# EAGLE design DenkyD4 (EAGLE 7.7.0)
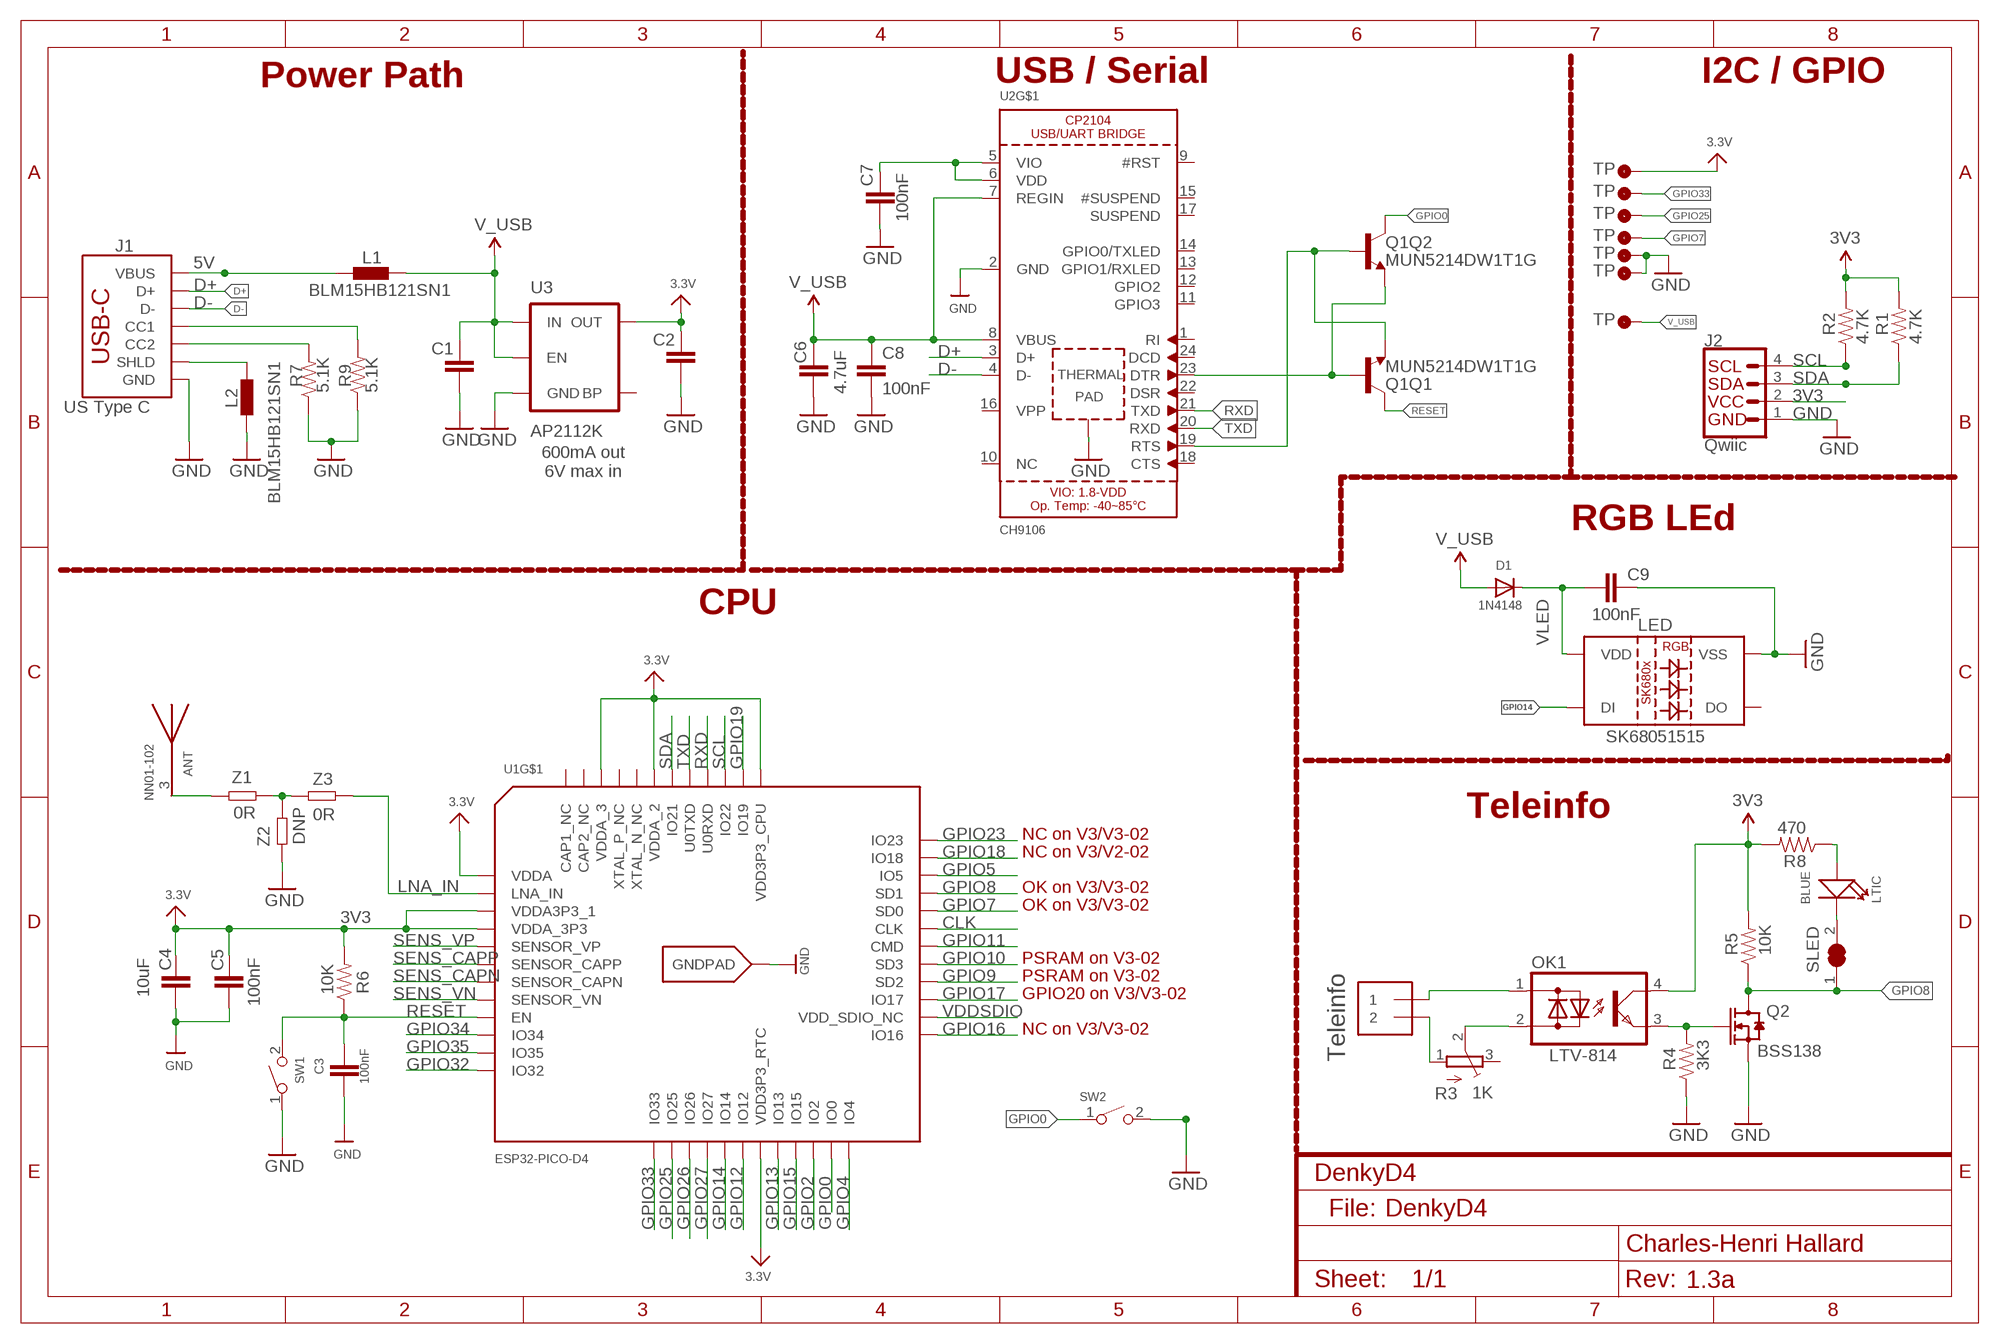
[diagram p0: schematic, sheet 1]
NAME (FRAME-A4L): CNAME: DenkyD4; CREVISION: 1.3a; DESIGNER: Charles-Henri Hallard

## Parts
ANT  NN01-102  NN01-102320  [XCVR_NN03-320]
C1  1.0uF  CAP0402-CAP-OK  [0402-CAP-OK]
C2  1.0uF  CAP0402-CAP-OK  [0402-CAP-OK]
C3  100nF  CAP0402-CAP-OK  [0402-CAP-OK]
C4  10uF  CAP0402-CAP-OK  [0402-CAP-OK]
C5  100nF  CAP0402-CAP-OK  [0402-CAP-OK]
C6  4.7uF  CAP0402-CAP-OK  [0402-CAP-OK]
C7  100nF  CAP0402-CAP-OK  [0402-CAP-OK]
C8  100nF  CAP0402-CAP-OK  [0402-CAP-OK]
C9  100nF  CAP0402-CAP-OK  [0402-CAP-OK]
D1  1N4148  DIODESOD-523  [SOD-523]
J1  US Type C  USB_C_4-LAYER-ISOLATED  [USB-C-16P-4LAYER-ISOLATED]
J2  Qwiic  QWIIC_CONNECTOR  [JST04_1MM_VERT]
J3  KF2EDGR-3.81-2P  1X2-3.5MM-3.5MM  [1X2-3.5MM]
L1  BLM15HB121SN1  [0402]
L2  BLM15HB121SN1  [0402]
LED  SK68051515  [SK6805-1515]
LTIC  BLUE  SMD-LED-CLEAR-BLUE(0402)  [LED-0402]
OK1  LTV-814  SFH6206  [DIL4-SMD]
Q1  MUN5214DW1T1G  MBT3904DW1T1  [DUAL_NPN_SC70-6]
Q2  BSS138  SMD-MOSFET-N-CH-20V-2.1A-CJ2302(SOT-23)  [SOT-323-3]
R1  4.7K  RESISTOR0402-RES  [0402-RES]
R2  4.7K  RESISTOR0402-RES  [0402-RES]
R3  1K  TRIMPOTTC33X  [TC33X]
R4  3K3  RESISTOR0402-RES  [0402-RES]
R5  10K  RESISTOR0402-RES  [0402-RES]
R6  10K  RESISTOR0402-RES  [0402-RES]
R7  5.1K  RESISTOR0402-RES  [0402-RES]
R8  470  RESISTOR0402-RES  [0402-RES]
R9  5.1K  RESISTOR0402-RES  [0402-RES]
SLED  SOLDERJUMPER_CLOSED  [SOLDERJUMPER_CLOSEDWIRE]
SW1  RESET  SMD-BUTTON(2P-3.0X2.5X1.2+0.4MM)  [C498294]
SW2  SMD-BUTTON(2P-3.0X2.5X1.2+0.4MM)  [C498294]
TGG  TP3  [TP60_BOT]
TGG1  TP3  [TP60_BOT]
TGG2  TP3  [TP60_BOT]
TP3  TP3  [TP60_BOT]
U1  ESP32-PICO-D4  [PICO-D4-QFN48]
U2  CH9106  CP2104  [QFN24_4MM_SMSC]
U3  AP2112K  V_REG_LDOSMD  [SOT23-5]
U$3  TP3  [TP60_BOT]
U$6  TP3  [TP60_BOT]
U$11  TP3  [TP60_BOT]
Z1  0R  MATCHNET  [0603-MATCHNET]
Z2  DNP  MATCHNET  [0603-MATCHNET]
Z3  0R  MATCHNET  [0603-MATCHNET]

## Nets
3V3: C2.1 C4.1 C5.1 J2.2 OK1.4(C) R1.2 R2.2 R5.2 R6.2 R8.2 TP3.P$1(TP) U1.1(VDDA) U1.3(VDDA3P3_1) U1.4(VDDA_3P3) U1.19(VDD3P3_RTC) U1.37(VDD3P3_CPU) U1.43(VDDA_2) U1.46(VDDA_3) U3.5(OUT) ; supply symbol labelled 3.3V
5V: J1.VBUS1(VBUS) J1.VBUS2(VBUS) L1.1
CLK: U1.31(CLK)
D+: J1.A6(D+) J1.B6(D+) U2.3(D+)
D-: J1.A7(D-) J1.B7(D-) U2.4(D-)
DTR: Q1.1(Q2:E) Q1.5(Q1:B) U2.23(DTR)
GND: C1.2 C2.2 C3.2 C4.2 C5.2 C6.1 C7.1 C8.2 C9.2 J1.GND J1.GND2(GND) J2.1 L2.2 LED.4(VSS) Q2.2(S) R4.1 R7.1 R9.1 SW1.1 SW2.2 TGG1.P$1(TP) TGG.P$1(TP) U1.EXP(GNDPAD) U2.2(GND) U2.THERM(TP) U3.2(GND) Z2.2
GPIO0: Q1.6(Q2:C) SW2.1 U1.23(IO0)
GPIO2: U1.22(IO2)
GPIO4: U1.24(IO4)
GPIO5: U1.34(IO5)
GPIO7: U1.32(SD0) U$3.P$1(TP)
GPIO8: Q2.3(D) R5.1 SLED.1 U1.33(SD1)
GPIO9: U1.28(SD2)
GPIO10: U1.29(SD3)
GPIO11: U1.30(CMD)
GPIO12: U1.18(IO12)
GPIO13: U1.20(IO13)
GPIO14: LED.1(DI) U1.17(IO14)
GPIO15: U1.21(IO15)
GPIO16: U1.25(IO16)
GPIO17: U1.27(IO17)
GPIO18: U1.35(IO18)
GPIO19: U1.38(IO19)
GPIO23: U1.36(IO23)
GPIO25: U1.14(IO25) U$11.P$1(TP)
GPIO26: U1.15(IO26)
GPIO27: U1.16(IO27)
GPIO32: U1.12(IO32)
GPIO33: U1.13(IO33) U$6.P$1(TP)
GPIO34: U1.10(IO34)
GPIO35: U1.11(IO35)
LNA_IN: U1.2(LNA_IN) Z3.2
N$1: Z1.1 Z2.1 Z3.1
N$2: OK1.3(E) Q2.1(G) R4.2
N$3: OK1.2(AC2) R3.2(S)
N$4: J3.1 OK1.1(AC1)
N$5: J3.2 R3.1(A)
N$6: LTIC.- SLED.2
N$8: C7.2 U2.5(VIO) U2.6(VDD)
N$10: LTIC.+ R8.1
N$11: J1.A5(CC1) R9.2
N$12: J1.B5(CC2) R7.2
N$13: ANT.3 Z1.2
RESET: C3.1 Q1.3(Q1:C) R6.1 SW1.2 U1.9(EN)
RTS: Q1.2(Q2:B) Q1.4(Q1:E) U2.19(RTS)
RXD: U1.40(U0RXD) U2.21(TXD)
SCL: J2.4 R2.1 U1.39(IO22)
SDA: J2.3 R1.1 U1.42(IO21)
SENS_CAPN: U1.7(SENSOR_CAPN)
SENS_CAPP: U1.6(SENSOR_CAPP)
SENS_VN: U1.8(SENSOR_VN)
SENS_VP: U1.5(SENSOR_VP)
SHIELD: J1.SHLD1(SHLD) J1.SHLD2(SHLD) J1.SHLD3(SHLD) J1.SHLD4(SHLD) J1.SHLD5(SHLD) J1.SHLD6(SHLD) J1.SHLD7(SHLD) J1.SHLD8(SHLD) L2.1
TXD: U1.41(U0TXD) U2.20(RXD)
V_USB: C1.1 C6.2 C8.1 D1.A L1.2 TGG2.P$1(TP) U2.7(REGIN) U2.8(VBUS) U3.1(IN) U3.3(EN)
VDDSDIO: U1.26(VDD_SDIO_NC)
VLED: C9.1 D1.K(C) LED.2(VDD)
Unconnected: LED.3(DO) R3.3(E) U1.44(XTAL_N_NC) U1.45(XTAL_P_NC) U1.47(CAP2_NC) U1.48(CAP1_NC) U2.1(RI) U2.9(#RST) U2.10(NC) U2.11(GPIO3) U2.12(GPIO2) U2.13(GPIO1/RXLED) U2.14(GPIO0/TXLED) U2.15(#SUSPEND) U2.16(VPP) U2.17(SUSPEND) U2.18(CTS) U2.22(DSR) U2.24(DCD) U3.4(BP)

## Notes on the sheet
- I2C / GPIO
- Power Path | USB / Serial
- 600mA out
  6V max in
- RGB LEd
- CPU
- Teleinfo
- NC on V3/V3-02
- NC on V3/V2-02
- OK on V3/V3-02
- OK on V3/V3-02
- PSRAM on V3-02
- PSRAM on V3-02
- GPIO20 on V3/V3-02
- NC on V3/V3-02
- Teleinfo
- File:

## Library data of the parts
ANT = _c2h:NN01-102: 2.45GHz Bluetooth, WLAN, Zigbee Chip RF Antenna 2.4GHz ~ 2.5GHz 1.7dBi Solder Surface Mount Check availability <https://pricing.snapeda.com/parts/NN01-102/Ignion/view-part?ref=eda>
C1-C9 = _c2h:CAP: Capacitor Standard 0603 ceramic capacitor, and 0.1" leaded capacitor.
D1 = microbuilder:DIODE: Diode SMA Model Volts Amps Type Vf Vr Digikey # Notes SSA34-E3 40V 3A Schottky 480mV @ 3A 200uA @ 40V SSA34-E3/61TGITR-ND CDBA120-G 20V 1A Schottky 500mV @ 1A 500uA @ 20V 641-1014-6-ND REEL MBRA210 10V 2A Schottky 350mV @ 2A 700uA @ 10V MBRA210LT3 SOD-123 Model Volts Amps Type Vf Vr Order # Notes BAT54T1G 30V 200mA Schottky 800mV @ 200mA 2uA @ 25V BAT54T1GOSTR-ND B0530W 30V 500mA Schottky 430mV @ 500mA 130uA @ 30V B0530W-FDICT-ND REEL MBR120 1A 20V Schottky 340mV @ 1A MBR120VLSFT1GOSCT-ND SOD-323 Model Volts Amps Type Vf Vr Order # Notes PMEG2005EJ 20V 500mA Schottky 355mV @ 500mA 568-4110-1-ND ZLLS410 10V 570mA Schottky 380mV @ 570mA ZLLS410CT-ND 1N4148WS 75V 150mA Silicon/Simple 1V 1N4148WSFSCT-ND REEL SOD-523 Model Volts Amps Type Vf Vr Order # Notes BAT54XV2 30V 200mA Schottky 0.8V @ 100mA BAT54XV2CT-ND TB751S 30V 30mA Schottky RB751S-40TE61CT-ND SOT23-R/W (R = Solder Paste/Reflow Ovens, W = Hand-Soldering) Model Volts Amps Type Vf Vr Order # Notes BAT54FILM 40V 300mA Schottky 497-7162-1-ND
J1 = SparkFun-Connectors:USB_C: USB Type C 16Pin Connector Super Speed pins not available on the 16-pin purely SMD connector so this part is best for USB 2.0 implementations. D1 and D2 are tied together enabling D+/- no matter which way the cable is plugged into the connector. The two channel configuration pins (CC1/2) are exposed. These are normally connected to ground via 5.1k resistors but can be reconfigured for high current/high power applications. **4-LAYER BOARD WARNING!!** If designing 4-layer board, make sure to select the variant _4-LAYER-ISOLATED. The linked footprint (USB-C-16-4LAYER-ISOLATED) includes some very necessary cutout polygons in the inner layers (2 and 15). This prevents the PTH mounting shield legs on the USB connector from electrically connecting any other polygons on the inner layers (usually VCC and GND).; PROD_ID: CONN-14122; VALUE: USB Female Type C Connector
J2 = _c2h:QWIIC_CONNECTOR: SparkFun I2C Standard Qwiic Connector An SMD 1mm pitch JST connector makes it easy and quick (get it? Qwiic?) to connect I2C devices to each other. The Qwiic system <http://www.sparkfun.com/qwiic> enables fast and solderless connection between popular platforms and various sensors and actuators. We carry 200mm <https://www.sparkfun.com/products/14204>, 100mm <https://www.sparkfun.com/products/14205>, 50mm <https://www.sparkfun.com/products/14206>, and breadboard friendly <https://www.sparkfun.com/products/14207> Qwiic cables. We also offer 10 pcs strips <https://www.sparkfun.com/products/14323> the SMD connectors.; PROD_ID: CONN-14483; VALUE: Vertical Qwiic Connector
J3 = _c2h:1X2-3.5MM: 3.5mm Terminal block http://www.ladyada.net/library/pcb/eaglelibrary.html
L1 L2 = inductors:BLM15H: EMIFIL (R) Chip Ferrite Bead for GHz Noise Source: http://www.murata.com/ Ferrite Bead BLM15H.pdf
LED = _c2h:SK6805
LTIC = OPL_Optoelectronics:SMD-LED-CLEAR-BLUE(0402): 304090075; MPN: BL-HB337A-AV-TRB; VALUE: BLUE-0402
OK1 = optocoupler:SFH620: Optocoupler, Phototransistor Output, AC Input Source: http://www.vishay.com/docs/83675/sfh620.pdf; MF: VISHAY/TELEFUNKEN; MPN: SFH6206-3; OC_FARNELL: 1469585; OC_NEWARK: 58K2214
Q1 = UnexpectedMaker:MBT3904DW1T1: MBT3904DW1 Dual NPN Transistors The MBT3904W1 puts two general purpose 3904 NPN transistors in a single package. Datasheet <http://www.onsemi.com/pub_link/Collateral/MBT3904DW1T1-D.PDF>; PROD_ID: TRANS-13337
Q2 = _c2h:SMD-MOSFET-N-CH-20V-2.1A-CJ2302(SOT-23): 305030015
R1 R2 R4-R7 R9 = _c2h:RESISTOR: Resistor Basic schematic elements and footprints for 0603, 1206, and PTH resistors.
R3 = adafruit:TRIMPOT: SMT trimmer potentiometer part number TC33X http://www.ladyada.net/library/eagle
R8 = LowPowerLab:RESISTOR: Resistor Basic schematic elements and footprints for 0603, 1206, and PTH resistors.
SLED = microbuilder:SOLDERJUMPER_CLOSED: Solder Jumper - Closed These solder jumpers are closed by default CLOSEDWIRE - 10 mil trace between pads that can be cut and resoldered later CLOSEDPERM - 63 mil trace between pads for a permanent connection (used to 'bridge' two signals, a shameless hack for Eagle). Can double as a test point as well (no cream layer)
SW1 SW2 = _c2h:SMD-BUTTON(2P-3.0X2.5X1.2+0.4MM): 311020047
TGG TGG1 TGG2 TP3 U$3 U$6 U$11 = Particle:TP: Test Points of all sizes and shapes
U1 = UnexpectedMaker:ESP32-PICO-D4
U2 = microbuilder:CP2104: CP2104 - USB to UART Bridge VDD Output: 3.45V
U3 = SparkFun-PowerIC:V_REG_LDO: Voltage Regulator LDO Standard 150mA LDO voltage regulator in SOT-23 layout. Micrel part MIC5205. BP (by-pass) pin is used to lower output noise with 470pF cap.; PROD_ID: VREG-12457
Z1-Z3 = _c2h:MATCHNET

## Net classes
0 default: width 0.203 mm, drill 0.254 mm, clearance 0.152 mm
1 power: width 0.203 mm, clearance 0.152 mm

## Board
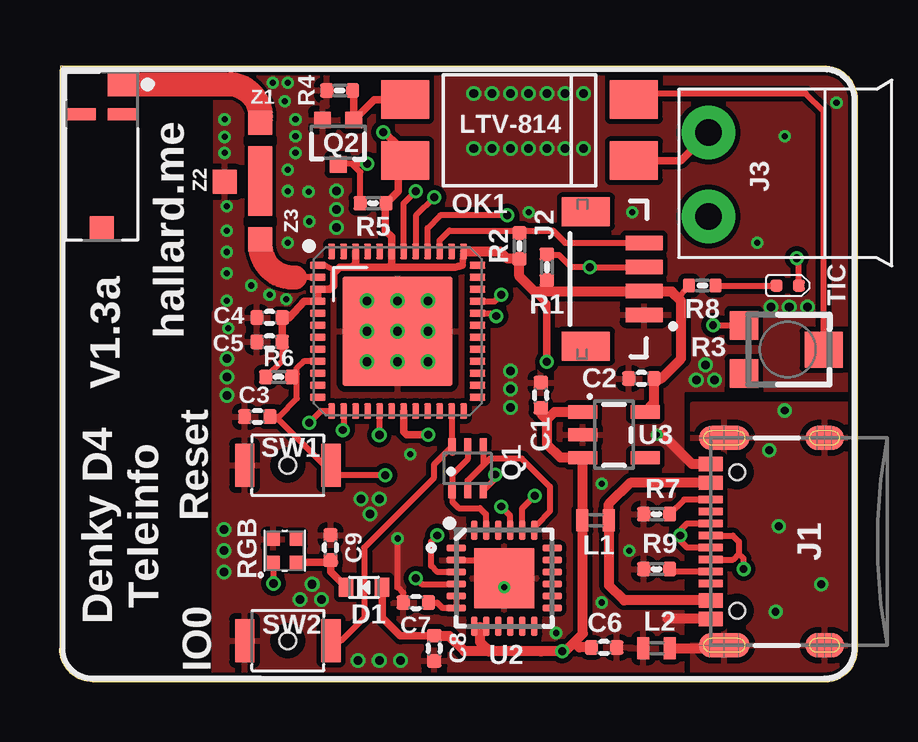
[diagram p1: board, top side]
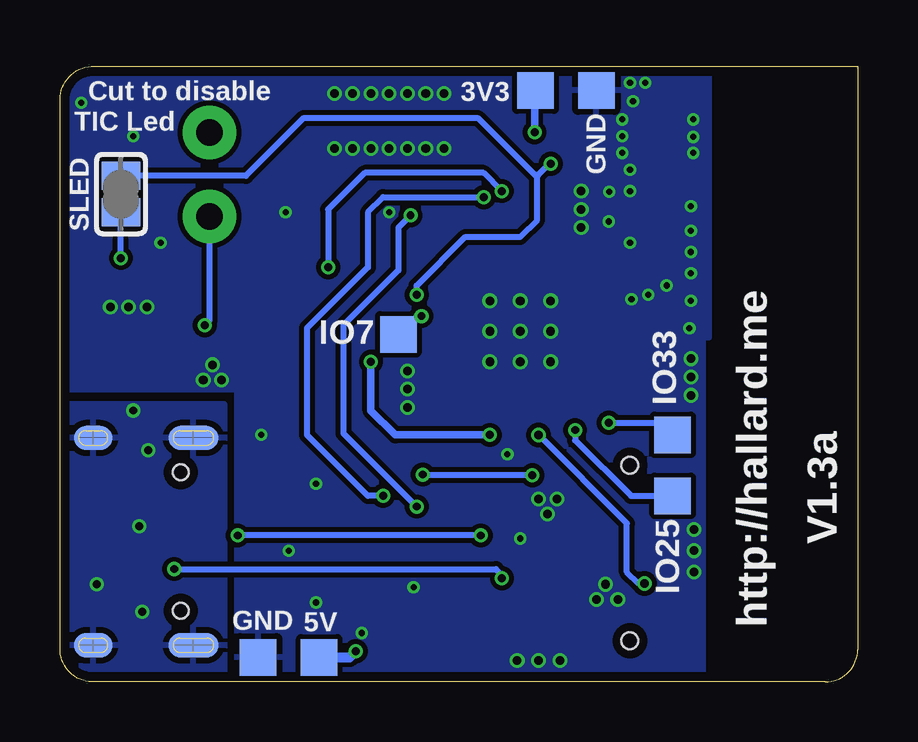
[diagram p2: board, bottom side, seen from below]

Size 33.24 x 25.65 mm. Coordinates in mm from the lower left corner, seen from the top.
Outline: 31.81,25.65 0,25.65 0,1.33 arc90 1.37,0 31.91,0 arc90 33.24,1.4 33.24,24.26 arc90 31.81,25.65
Copper layers (1*16): Top 0.035559375mm / dielectric 1.6mm / Bottom 0.035559375mm
Design rules "oshpark-2layer *": minimum track width 6mil, minimum drill 10mil, track to track 6mil, track to pad 6mil, pad to pad 6mil, via to via 6mil, smd to smd 6mil, copper to edge 15mil, drill to drill 6mil, minimum pad ring 5mil, minimum via ring 5mil, stop-mask expansion 2.5mil, vias tented up to drill 30mil, thermal gap 10mil
tKeepout: area 6.3,21.7 to 7.2,23.7; area 9.4,21.7 to 10.3,23.7

### Footprints (pad centres in the part's own frame; a part is rotated, then mirrored left to right if it is on the bottom)
XCVR_NN03-320 = smd 1 x 1: 1 -3,0 | smd 0.5 x 1.25: 2 1.75,-0.875; 4 1.75,0.875 | smd 1 x 1.25: 3 3,-0.875
0402-CAP-OK = smd 0.56 x 0.6: 1 -0.521,0; 2 0.525,0
SOD-523 = smd 0.8 x 0.6: A 0,-0.75; K 0,0.75
USB-C-16P-4LAYER-ISOLATED = smd 0.3 x 1: A5 -1.25,3.47; A6 -0.25,3.47; A7 0.25,3.47; A8 1.25,3.47; B5 1.75,3.47; B6 0.75,3.47; B7 -0.75,3.47; B8 -1.75,3.47 | smd 0.6 x 1: GND -3.225,3.47; GND2 3.225,3.47; VBUS1 -2.45,3.47; VBUS2 2.45,3.47 | smd 1 x 2.1: SHLD1 -4.32,2.895; SHLD2 4.32,2.895 | smd 1 x 2.1 bottom: SHLD3 -4.32,2.895; SHLD4 4.32,2.895 | smd 1 x 1.6: SHLD5 -4.32,-1.285; SHLD8 4.32,-1.285 | smd 1 x 1.6 bottom: SHLD6 -4.32,-1.285; SHLD7 4.32,-1.285 | hole 0.65: -2.89,2.365; 2.89,2.365
JST04_1MM_VERT = smd 0.6 x 1.55: 1 -1.478,0.775; 2 -0.478,0.775; 3 0.522,0.775; 4 1.522,0.775 | smd 1.2 x 2: NC1 -2.778,3.2; NC2 2.822,3.2
1X2-3.5MM = drill 1.1 pad 2.235: 1 1.8,0; 2 -1.7,0
0402 = smd 0.5 x 0.9: 1 -0.55,0; 2 0.55,0
SK6805-1515 = smd 0.55 x 0.55: 1 0.475,-0.48; 2 0.475,0.48; 3 -0.475,0.48; 4 -0.475,-0.48
LED-0402 = smd 0.5 x 0.5: + -0.463,0; - 0.463,0
DIL4-SMD = smd 1.6 x 2: 1 -1.27,-4.77; 2 1.27,-4.77; 3 1.27,4.77; 4 -1.27,4.77
DUAL_NPN_SC70-6 = smd 0.3 x 0.66: 1 -0.65,-0.92; 2 0,-0.92; 3 0.65,-0.92; 4 0.65,0.92; 5 0,0.92; 6 -0.65,0.92
SOT-323-3 = smd 0.7 x 0.7: 1 -0.65,-0.925; 2 0.65,-0.925; 3 0,0.925
0402-RES = smd 0.56 x 0.6: 1 -0.534,0; 2 0.534,0
TC33X = smd 1.2 x 1.2: 1 -1,-1.825; 3 1,-1.825 | smd 1.5 x 1.6: 2 0,1.5
0402-RES' = smd 0.5 x 0.6: 1 -0.55,0; 2 0.55,0
SOLDERJUMPER_CLOSEDWIRE = smd 1.168 x 1.6: 1 -0.762,0; 2 0.762,0 | smd 0.635 x 0.203: WIRE 0,0
C498294 = smd 0.8 x 1.8: 1 -1.8,0; 2 1.8,0 | hole 0.69: 0,0
TP60_BOT = smd 1.524 x 1.524 bottom: P$1 0,0
PICO-D4-QFN48 = smd 0.66 x 0.3: 1 -3.327,2.75; 2 -3.327,2.25; 3 -3.327,1.75; 4 -3.327,1.25; 5 -3.327,0.75; 6 -3.327,0.25; 7 -3.327,-0.25; 8 -3.327,-0.75; 9 -3.327,-1.25; 10 -3.327,-1.75; 11 -3.327,-2.25; 12 -3.327,-2.75; 25 3.327,-2.75; 26 3.327,-2.25; 27 3.327,-1.75; 28 3.327,-1.25; 29 3.327,-0.75; 30 3.327,-0.25; 31 3.327,0.25; 32 3.327,0.75; 33 3.327,1.25; 34 3.327,1.75; 35 3.327,2.25; 36 3.327,2.75 | smd 0.3 x 0.66: 13 -2.75,-3.327; 14 -2.25,-3.327; 15 -1.75,-3.327; 16 -1.25,-3.327; 17 -0.75,-3.327; 18 -0.25,-3.327; 19 0.25,-3.327; 20 0.75,-3.327; 21 1.25,-3.327; 22 1.75,-3.327; 23 2.25,-3.327; 24 2.75,-3.327; 37 2.75,3.327; 38 2.25,3.327; 39 1.75,3.327; 40 1.25,3.327; 41 0.75,3.327; 42 0.25,3.327; 43 -0.25,3.327; 44 -0.75,3.327; 45 -1.25,3.327; 46 -1.75,3.327; 47 -2.25,3.327; 48 -2.75,3.327 | smd 4.572 x 4.572: EXP 0,0
QFN24_4MM_SMSC = smd 0.8 x 0.28: 1 -2,1.25; 2 -2,0.75; 3 -2,0.25; 4 -2,-0.25; 5 -2,-0.75; 6 -2,-1.25; 13 2,-1.25; 14 2,-0.75; 15 2,-0.25; 16 2,0.25; 17 2,0.75; 18 2,1.25 | smd 0.28 x 0.8: 7 -1.25,-2; 8 -0.75,-2; 9 -0.25,-2; 10 0.25,-2; 11 0.75,-2; 12 1.25,-2; 19 1.25,2; 20 0.75,2; 21 0.25,2; 22 -0.25,2; 23 -0.75,2; 24 -1.25,2 | smd 2.5 x 2.5: THERM 0,0
SOT23-5 = smd 0.55 x 1.2: 1 -0.95,-1.3; 2 0,-1.3; 3 0.95,-1.3; 4 0.95,1.3; 5 -0.95,1.3
0603-MATCHNET = smd 1 x 1: 1 -0.736,0; 2 0.748,0

### Placement (x,y rotation side)
ANT  1.75,21.91 90 top
C1  20.03,11.94 90 top
C2  24.23,12.64 180 top
C3  8.22,11.05 180 top
C4  8.73,15.18 180 top
C5  8.73,14.16 180 top
C6  22.67,1.43 180 top
C7  14.83,3.3 0 top
C8  15.59,1.4 270 top
C9  11.27,5.59 90 top
D1  12.67,3.94 90 top
J1  30.58,5.84 90 top
J2  25.11,16.76 90 top
J3  27.02,21.08 90 top
L1  22.32,6.73 180 top
L2  24.86,1.4 180 top
LED  9.37,5.46 270 top
LTIC  30.32,16.51 0 top
OK1  19.15,22.99 90 top
Q1  16.99,8.89 0 top
Q2  11.59,22.48 180 top
R1  20.29,17.27 270 top
R2  19.15,18.16 270 top
R3  30.32,13.84 270 top
R4  11.65,24.64 0 top
R5  13.05,19.94 0 top
R6  9.11,12.7 180 top
R7  24.86,6.98 0 top
R8  470  [0402-RES']  26.77,16.51 180 top
R9  24.86,4.7 0 top
SLED  30.7,20.32 270 bottom
SW1  9.49,9.02 0 top
SW2  9.49,1.71 180 top
TGG  10.89,24.64 0 top
TGG1  24.99,1.02 0 top
TGG2  22.45,1.02 0 top
TP3  13.43,24.64 0 top
U1  14.07,14.61 0 top
U2  18.51,4.32 0 top
U3  23.08,10.29 270 top
U$3  19.15,14.48 0 top
U$6  7.72,10.29 0 top
U$11  7.72,7.75 0 top
Z1  8.35,22.54 90 top
Z2  7.61,20.83 180 top
Z3  8.35,19.18 270 top

### Tracks (layer width: path | path; a pad name or v marks a point on that pad's centre or on a via)
3V3  (via drill 0.33)
  Top 0.254: 11.4,17.14 11.03,17.36 U1.1 | 14.32,10.67 U1.19 | R1.2 20.29,16.26 | R8.2 25.83,16.09 25.88,15.88 | C5.1 9.25,13.37 R6.2
  Top 0.279: 11.4,17.02 11.4,17.14 | U1.37 16.75,17.36
  Top 0.305: U1.46 12.32,17.43 12.16,17.27 | 12.16,17.27 11.65,17.27 11.4,17.02 11.4,16.51 11.24,16.36 U1.3 U1.4 10.17,15.86 9.56,15.18 C4.1 C5.1 | 13.68,17.27 13.82,17.4 U1.43 13.82,18.54 13.56,18.8 13.56,19.91 R5.2 14.09,20.45 14.09,21.43 OK1.4 | 13.68,17.27 12.16,17.27 | 24.31,16.26 J2.2 | 16.75,17.36 16.48,17.27 13.68,17.27 | U1.19 14.32,10.41 14.45,10.29 v15.34,10.29 | v20.29,13.34 20.29,15.75 19.78,16.26 | 16.96,17.93 U1.37 | OK1.4 14.26,21.72 | v13.47,22.9 13.52,22.9 14.07,22.35 14.07,22.03 OK1.4
  Top 0.406: J2.2 24.37,16.26 25.5,16.26 25.88,15.88 25.88,13.46 25.05,12.64 C2.1 24.75,11.6 U3.5 | U3.5 24.38,11.33 | 24.37,11.25 U3.5 | 24.31,16.26 20.29,16.26 19.78,16.26 19.15,16.89 R2.2 19.12,17.65 18.61,17.65 18.33,17.93 16.96,17.93
  Bottom 0.305: v20.29,13.34 20.29,11.3 19.27,10.29 v15.34,10.29 | 13.24,24.7 TP3.P$1 13.47,24.85 v13.47,22.9
5V
  Top 0.406: J1.VBUS2 23.75,8.29 22.87,7.41 L1.1 22.87,4.02 23.5,3.39 J1.VBUS1
D+  (via drill 0.33)
  Top 0.254: J1.A6 26.13,5.59 25.88,5.84 | J1.B6 26.12,6.59 25.88,6.35 25.88,5.84 | U2.3 15.72,4.57 15.46,4.83 15.46,5.84 v15.72,6.1 | v25.84,6.1 25.84,5.87 25.88,5.84
  Bottom 0.254: v15.72,6.1 v25.84,6.1
D-  (via drill 0.33)
  Top 0.254: J1.A7 28.04,6.09 28.29,5.84 28.29,5.33 | v14.83,4.32 15.08,4.06 U2.4 | J1.B7 28.05,5.09 28.29,5.33 | v28.48,4.7 28.48,5.14 28.29,5.33
  Bottom 0.254: v28.48,4.7 15.08,4.7 14.83,4.45 v14.83,4.32
DTR
  Top 0.254: Q1.5 16.99,9.27 16.35,8.64 16.35,7.98 | 16.35,7.98 Q1.1 | 16.35,7.98 16.35,7.49 16.61,7.24 17.49,7.24 17.75,6.98 17.75,6.58 U2.23
GND  (via drill 0.25, 0.36)
  Top 0.254: U2.2 17.76,5.07 v18.51,3.94 | C7.1 14.31,3.7 14.07,3.94 v14.07,5.97
  Top 0.406: J1.GND 25.32,2.62 | J1.GND2 26.33,9.07 25.11,10.29 v24.86,10.29
  other vias: 14.07,14.61 12.8,14.61 12.8,15.88 14.07,15.88 15.34,15.88 15.34,14.61 15.34,13.34 14.07,13.34 12.8,13.34 10.36,20.42 6.95,19.81 6.95,18.8 6.95,17.91 6.95,17.02 6.95,15.88 7.02,14.73 8.73,16.13 10.38,19.18 9.49,18.29 8.86,24.96 11.53,20.45 11.53,18.92 11.53,19.68 6.95,12.7 6.95,13.46 6.95,11.94 27.27,12.57 26.89,13.21 23.84,19.56 18.76,11.43 18.76,12.95 18.76,12.19 12.54,7.62 13.3,7.62 12.92,6.98 22.57,8.25 20.67,2.03 9.37,24.19 9.49,24.96 9.49,20.45 9.49,21.34 6.86,22.7 6.86,23.43 6.86,22.03 9.81,22.73 9.81,22.03 9.81,23.43 17.24,24.51 18,24.51 18.76,24.51 19.53,24.51 20.29,24.51 21.05,24.51 21.81,24.51 17.24,22.23 18,22.23 18.76,22.23 19.53,22.23 20.29,22.23 21.05,22.23 21.81,22.23 7.97,16.51 10.51,4.06 10,3.43 10.89,3.43 22.57,3.3 6.83,6.35 6.83,5.46 6.83,4.57 23.72,5.46 30.19,22.73 29.05,18.29 19.53,19.56 30.38,15.62 29.62,15.62 31.15,15.62 26.51,12.57 32.35,24.13 12.41,0.89 13.3,0.89 14.19,0.89 14.6,9.47 9.43,15.94
  pour Bottom (isolate 0.203): 34.39,26.8 34.39,12.19 25.88,12.19 25.88,-1.14 6.45,-1.14 6.45,14.35 6.19,14.35 6.19,26.8
  pour Top (isolate 0.203): 10.64,26.16 33.75,26.16 33.75,12.19 25.88,12.19 25.88,-0.51 6.45,-0.51 6.45,15.37 10.64,15.37
  pour Top (isolate 0.13): 6.45,26.16 10.89,26.16 10.89,15.37 6.45,15.37
GPIO0
  Top 0.254: 16.35,9.52 16.35,9.79 Q1.6 | Q1.6 15.59,9.06 15.59,8.51 12.67,5.59 12.67,2.67 11.72,1.71 SW2.1 | U1.23 16.32,9.83 Q1.6
GPIO7  (via drill 0.33)
  Top 0.254: U1.32 18.09,15.36 v18.18,15.24
  Bottom 0.254: v18.18,15.24 18.38,15.24 U$3.P$1
GPIO8  (via drill 0.33)
  Top 0.254: U1.33 18.11,15.86 v18.38,16.13 | v12.8,21.59 12.16,21.59 | 12.16,21.59 11.63,21.59 Q2.3 | R5.1 12.52,21.23 12.16,21.59
  Bottom 0.254: v18.38,16.13 18.38,16.51 16.35,18.54 14.07,18.54 13.37,19.24 13.37,21.02 | 13.37,21.02 15.84,23.5 23.08,23.5 25.5,21.08 SLED.1 | 13.37,21.02 13.37,21.08 12.86,21.59 v12.8,21.59
GPIO14  (via drill 0.36)
  Top 0.254: U1.17 13.3,11.27 v13.3,10.29 | LED.1 v8.89,4.1
  Bottom 0.254: v8.89,4.1 9.14,4.1 9.62,4.57 9.62,6.6 v13.3,10.29
GPIO25  (via drill 0.33)
  Top 0.254: U1.14 11.82,10.55 v11.78,10.49
  Bottom 0.254: v11.78,10.49 11.78,10.06 9.44,7.75 U$11.P$1
GPIO33  (via drill 0.33)
  Top 0.254: U1.13 10.87,11.28 v10.38,10.79
  Bottom 0.254: v10.38,10.79 8.22,10.79 U$6.P$1
LNA_IN
  Top 0.254: U1.2 10.44,16.86 9.8,16.85 | Z3.2 8.35,18.25
  Top 0.4: 9.8,16.85 9.8,16.86
  Top 1: 9.8,16.85 9.62,16.85 arc-90 8.35,18.25
N$1
  Top 0.254: Z3.1 8.35,20.8 Z2.1 8.32,21.78 Z1.1
N$2
  Top 0.305: R4.2 12.24,24.59 Q2.1 13.09,24.26 OK1.3
N$3
  Top 0.254: OK1.2 24.17,24.51 31.08,24.51 31.82,23.77 R3.2
N$4
  Top 0.305: OK1.1 25.85,21.72 J3.1
N$5  (via drill 0.33)
  Top 0.254: v27.21,14.86 28.48,14.86 R3.1
  Bottom 0.254: J3.2 27.02,15.05 v27.21,14.86
N$6  (via drill 0.33)
  Top 0.254: LTIC.- 30.78,17.57 v30.7,17.65
  Bottom 0.254: v30.7,17.65 SLED.2
N$8
  Top 0.254: U2.5 U2.6 15.95,3.07 15.72,3.3 C7.2
N$10
  Top 0.254: R8.1 LTIC.+
N$11
  Top 0.254: J1.A5 25.41,4.59 R9.2
N$12
  Top 0.254: J1.B5 26,7.59 R7.2
N$13
  Top 0.254: 8.35,23.37 Z1.2
  Top 1: 8.35,23.37 arc90 7.13,24.91 ANT.3
RESET  (via drill 0.33)
  Top 0.254: U1.9 10.15,13.36 9.87,13.08 9.87,12.83 | 9.87,12.83 9.87,11.81 9.11,11.05 8.99,11.05 | v18.13,8.64 18.13,8.46 Q1.3 | v13.56,8.61 11.04,8.61 SW1.2 11.26,9.01 11.39,9.03 11,9.03 8.99,11.05 | C3.1 8.99,11.05 | R6.1 9.75,12.7 9.87,12.83
  Bottom 0.254: v18.13,8.64 13.58,8.64 v13.56,8.61
RTS
  Top 0.254: 17.64,9.03 16.99,8.38 Q1.2 | Q1.4 17.64,9.03 | 17.64,9.41 17.64,9.03 | U2.19 19.88,6.57 20.42,7.11 20.42,8.13 19.24,9.3 17.91,9.3 17.64,9.03
RXD  (via drill 0.33)
  Top 0.254: U2.21 18.76,6.92 v18.38,7.3 | v18.64,19.43 15.84,19.43 15.32,18.9 U1.40
  Bottom 0.254: v18.64,19.43 19.15,18.92 19.15,17.14 21.43,14.86 21.43,10.35 v18.38,7.3
SCL
  Top 0.254: U1.39 15.82,18.39 16.22,18.8 19.15,18.8 | 19.15,18.8 20.54,18.8 21.05,18.29 J2.4 | R2.1 19.15,18.8
SDA  (via drill 0.33)
  Top 0.254: U1.42 14.32,19.93 v14.83,20.45 | J2.3 24.33,17.27 v22.07,17.27 21.3,17.27 20.8,17.78 20.31,17.78 R1.1
  Bottom 0.254: v14.83,20.45 15.59,21.21 20.54,21.21 22.07,19.68 v22.07,17.27
SHIELD  (via drill 0.33)
  Top 0.406: L2.1 27.56,1.4 J1.SHLD1
  Bottom 0.406: 31.72,1.52 31.85,1.4
  other vias: 29.94,6.48 29.56,9.65 29.81,2.92 30.19,11.3 31.72,4.06
  pour Top (isolate 0.203): 26.38,11.56 33.75,11.56 33.75,-0.51 26.38,-0.51
  pour Bottom (isolate 0.203): 34.39,11.56 34.39,-1.14 26.38,-1.14 26.38,11.56
TXD  (via drill 0.33)
  Top 0.254: U2.20 19.26,7.23 v19.78,7.75 | v15.59,20.19 14.83,19.43 14.83,17.94 U1.41
  Bottom 0.254: v15.59,20.19 19.78,20.19 20.42,19.56 20.42,17.27 22.96,14.73 22.96,10.29 20.42,7.75 v19.78,7.75
V_USB  (via drill 0.33)
  Top 0.254: U2.8 U2.7 17.24,2.3 17.48,2.3 17.49,2.29 | L1.2 21.77,7.1 21.78,7.11
  Top 0.305: C8.1 14.18,1.92 13.43,2.67 13.43,4.18 D1.A
  Top 0.406: 21.43,1.65 21.78,2 21.78,7.11 U3.3 20.86,9.34 20.29,9.91 20.29,10.92 | 21.43,1.65 21.05,1.27 v20.92,1.27 20.03,1.27 17.88,1.27 | 17.49,2.29 17.49,1.65 17.88,1.27 | 17.88,1.27 16.86,1.27 16.22,1.9 15.6,1.9 C8.1 | C6.2 21.65,1.43 21.43,1.65 | U3.1 20.6,11.24 20.29,10.92 | C1.1 20.03,11.18 20.29,10.92
  Bottom 0.406: TGG2.P$1 21.18,1.02 v20.92,1.27
VLED
  Top 0.305: LED.2 11.44,4.99 C9.1 11.27,4.58 D1.K

### Text on the board
tPlace: Z1 | Z2 | hallard.me | Z3 | TIC | Reset | Denky D4 / Teleinfo | IO0
tNames: V1.3a | RGB
bNames: 3V3 | Cut to disable | GND | TIC Led | IO7 | IO33 | http://hallard.me | V1.3a | IO25 | 5V | GND
bStop: Denky | D4